# Altium schematic sheet LED_adapt.SchDoc
size A
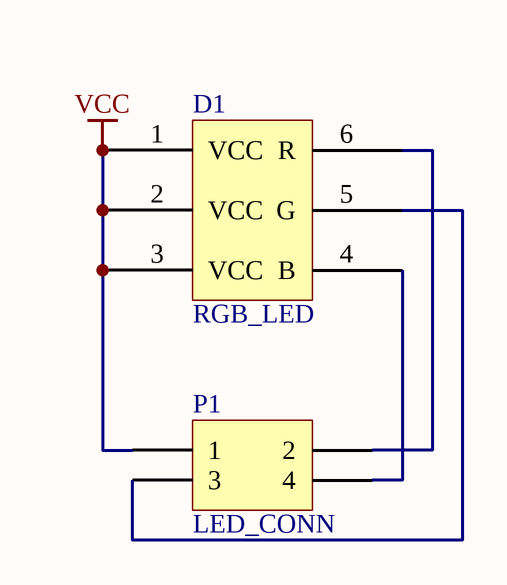
[diagram p0: LED_adapt.SchDoc]

## Parts
D1  RGB_LED  [CREE_LED]
P1  LED_CONN  [HDR2X2]

## Nets
VCC: D1.1(VCC) D1.2(VCC) D1.3(VCC) P1.1
NetD1_4: D1.4(B) P1.4
NetD1_5: D1.5(G) P1.3
NetD1_6: D1.6(R) P1.2

## Library data of the parts
D1 = CREE_LED
P1 = Header 2X2: Header, 2-Pin, Dual row; LatestRevisionDate: 17-Jul-2002; LatestRevisionNote: Re-released for DXP Platform.; Publisher: Altium Limited